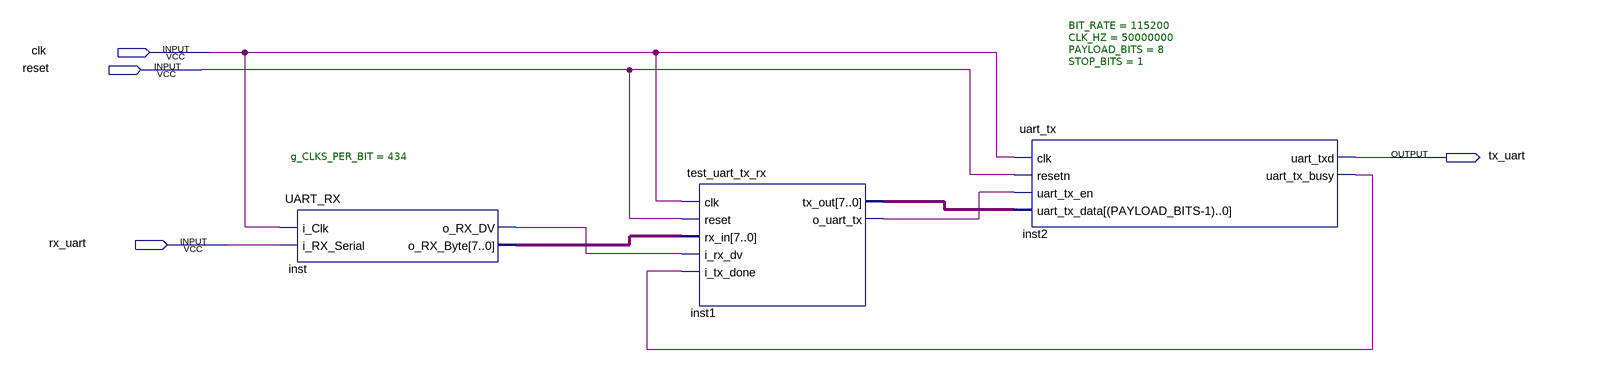
[diagram p0: schematic sheet]
// Quartus schematic top.bdf as structural Verilog: 3 symbols, 4 pins
module top (
  input  clk,
  input  reset,
  input  rx_uart,
  output tx_uart
);

  wire inst1_o_uart_tx, inst2_uart_tx_busy, inst_o_rx_dv;
  wire [7:0] inst1_tx_out, inst_o_rx_byte;

  UART_RX #(.g_CLKS_PER_BIT(434)) inst (
    .i_Clk(clk), .i_RX_Serial(rx_uart), .o_RX_DV(inst_o_rx_dv), .o_RX_Byte(inst_o_rx_byte));
  test_uart_tx_rx inst1 (
    .clk(clk), .reset(reset), .rx_in(inst_o_rx_byte), .i_rx_dv(inst_o_rx_dv), .i_tx_done(inst2_uart_tx_busy),
    .tx_out(inst1_tx_out), .o_uart_tx(inst1_o_uart_tx));
  uart_tx #(.BIT_RATE(115200), .CLK_HZ(50000000), .PAYLOAD_BITS(8), .STOP_BITS(1)) inst2 (
    .clk(clk), .resetn(reset), .uart_tx_en(inst1_o_uart_tx), .uart_tx_data(inst1_tx_out), .uart_txd(tx_uart),
    .uart_tx_busy(inst2_uart_tx_busy));
endmodule
